# EAGLE schematic MacroPad (EAGLE 9.4.0)
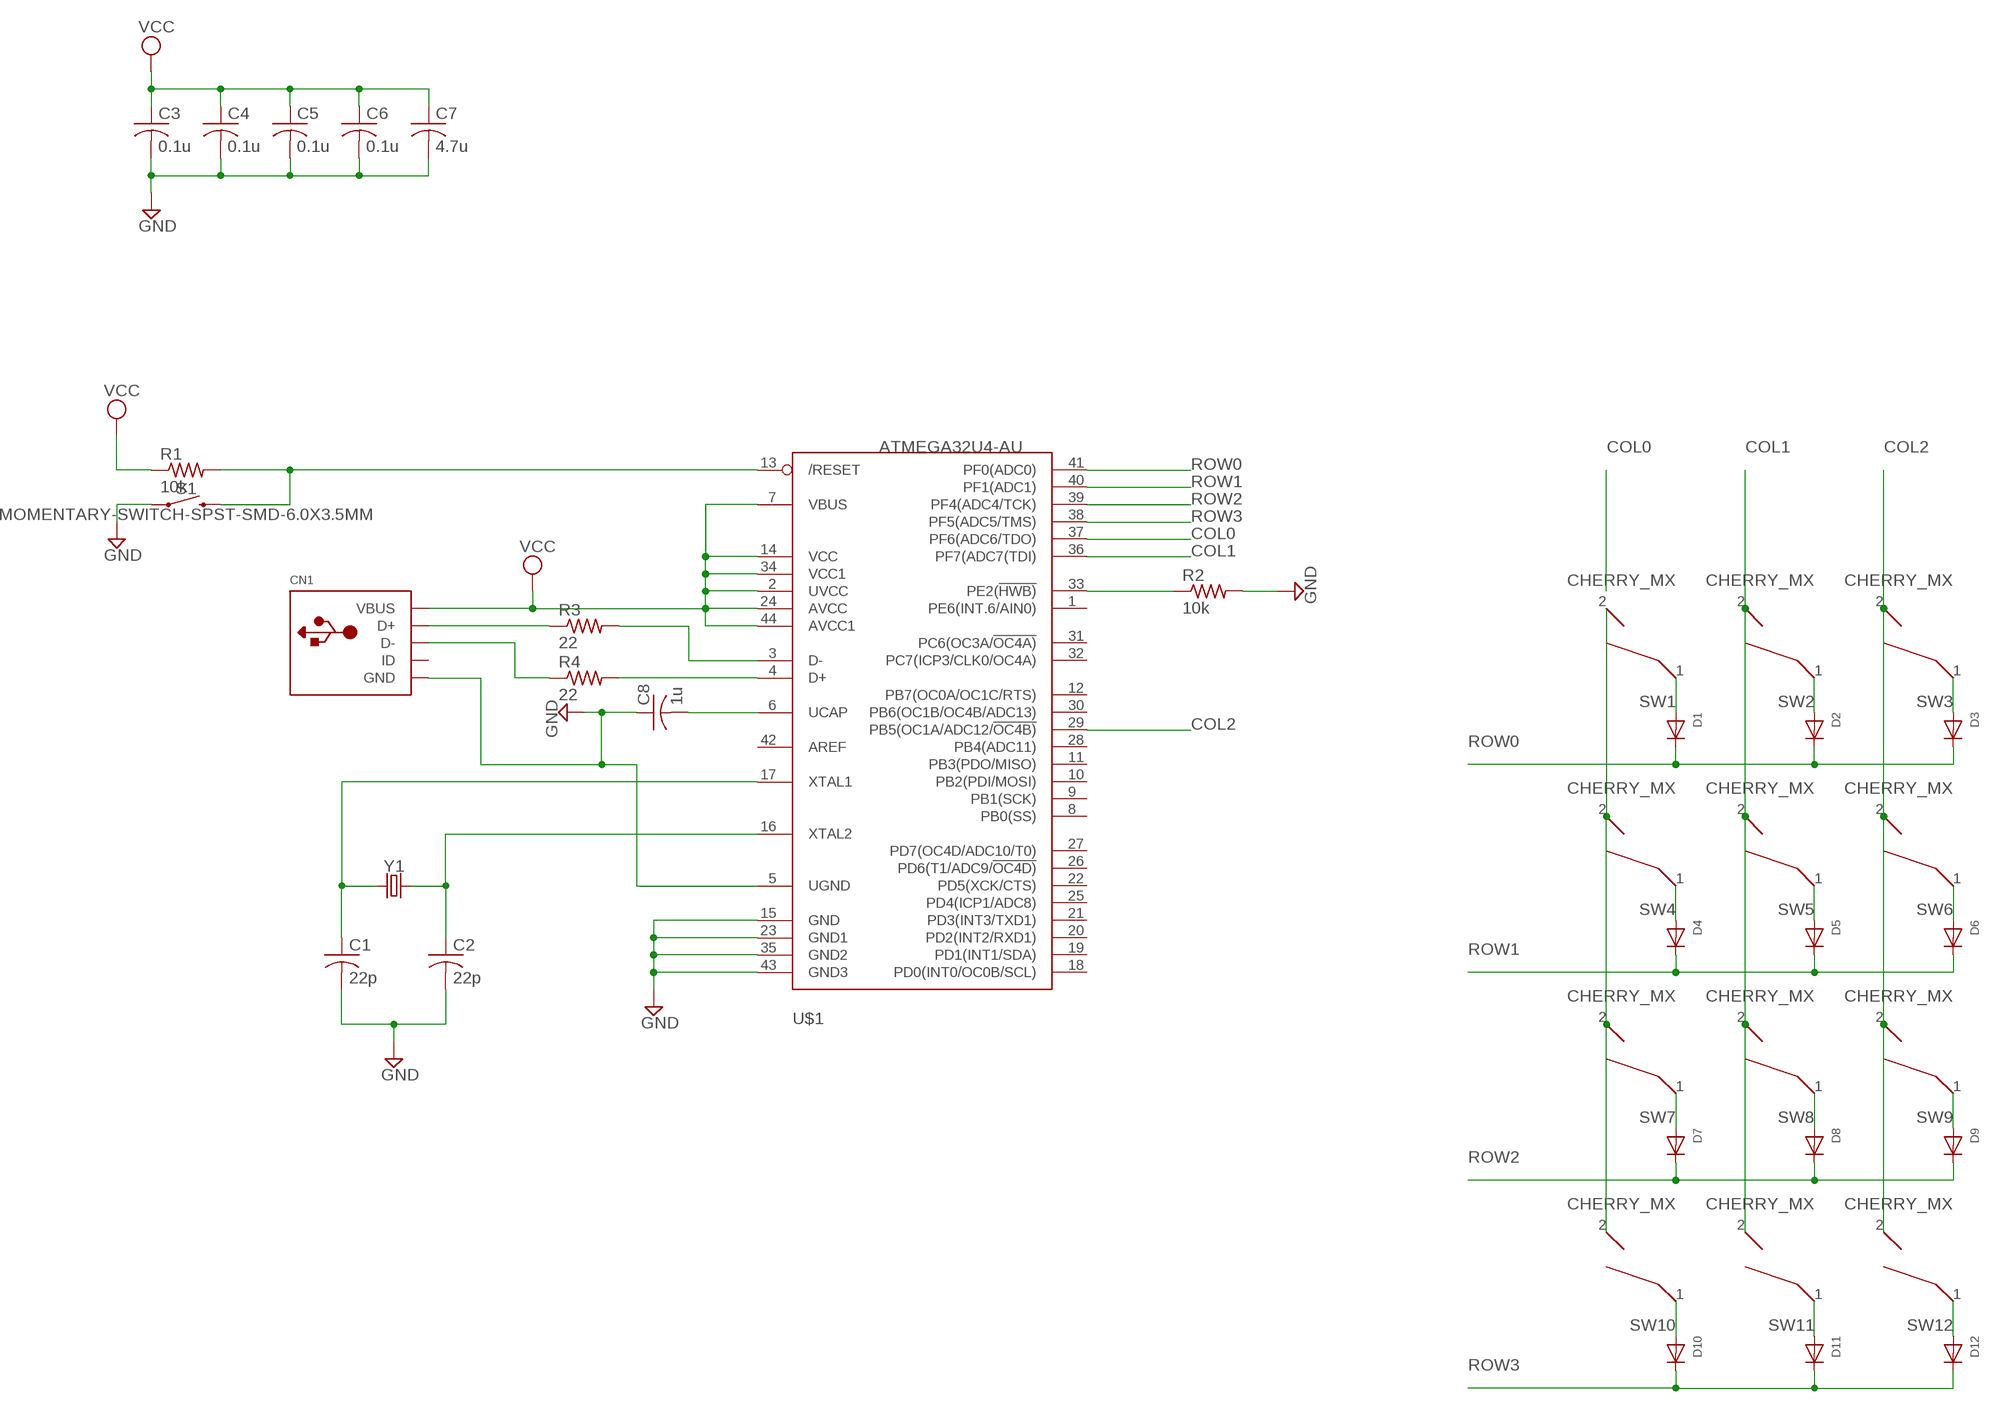
[diagram p0: schematic, sheet 1]

## Parts
C1  22p  C-USC0805  [C0805]
C2  22p  C-USC0805  [C0805]
C3  0.1u  C-USC0805  [C0805]
C4  0.1u  C-USC0805  [C0805]
C5  0.1u  C-USC0805  [C0805]
C6  0.1u  C-USC0805  [C0805]
C7  4.7u  C-USC0805  [C0805]
C8  1u  C-USC0805  [C0805]
CN1  USBMOLEX  [USB-MINIB-THM-MOLEX]
D1  DIODEDO-1N4148  [DO-1N4148]
D2  DIODEDO-1N4148  [DO-1N4148]
D3  DIODEDO-1N4148  [DO-1N4148]
D4  DIODEDO-1N4148  [DO-1N4148]
D5  DIODEDO-1N4148  [DO-1N4148]
D6  DIODEDO-1N4148  [DO-1N4148]
D7  DIODEDO-1N4148  [DO-1N4148]
D8  DIODEDO-1N4148  [DO-1N4148]
D9  DIODEDO-1N4148  [DO-1N4148]
D10  DIODEDO-1N4148  [DO-1N4148]
D11  DIODEDO-1N4148  [DO-1N4148]
D12  DIODEDO-1N4148  [DO-1N4148]
R1  10k  R-US_R0805  [R0805]
R2  10k  R-US_R0805  [R0805]
R3  22  R-US_R0805  [R0805]
R4  22  R-US_R0805  [R0805]
S1  MOMENTARY-SWITCH-SPST-SMD-6.0X3.5MM  [TACTILE_SWITCH_SMD_6.0X3.5MM]
SW1  CHERRY_MX  [MX1A-XXNN]
SW2  CHERRY_MX  [MX1A-XXNN]
SW3  CHERRY_MX  [MX1A-XXNN]
SW4  CHERRY_MX  [MX1A-XXNN]
SW5  CHERRY_MX  [MX1A-XXNN]
SW6  CHERRY_MX  [MX1A-XXNN]
SW7  CHERRY_MX  [MX1A-XXNN]
SW8  CHERRY_MX  [MX1A-XXNN]
SW9  CHERRY_MX  [MX1A-XXNN]
SW10  CHERRY_MX  [MX1A-XXNN]
SW11  CHERRY_MX  [MX1A-XXNN]
SW12  CHERRY_MX  [MX1A-XXNN]
U$1  ATMEGA32U4-AU  [TQFP44]
Y1  CRYSTALSMD-5X3.2-4PAD  [CRYSTAL-SMD-5X3.2-4PAD]

## Nets
COL0: U$1.37(PF6(ADC6/TDO))
COL1: SW2.2 SW5.2 SW8.2 SW11.2 U$1.36(PF7(ADC7(TDI))
COL2: SW3.2 SW6.2 SW9.2 SW12.2 U$1.29(PB5(OC1A/ADC12/!OC4B))
GND: C1.2 C2.2 C3.2 C4.2 C5.2 C6.2 C7.2 C8.1 CN1.GND R2.2 S1.1 U$1.5(UGND) U$1.15(GND) U$1.23(GND1) U$1.35(GND2) U$1.43(GND3)
N$1: C2.1 U$1.16(XTAL2) Y1.3
N$2: R2.1 U$1.33(PE2(!HWB))
N$3: C8.2 U$1.6(UCAP)
N$4: C1.1 U$1.17(XTAL1) Y1.1
N$5: R1.2 S1.2 U$1.13(/RESET)
N$6: CN1.D+ R3.1
N$7: R3.2 U$1.3(D-)
N$8: R4.2 U$1.4(D+)
N$9: CN1.D- R4.1
N$14: D1.A SW1.1
N$15: D2.A SW2.1
N$16: D3.A SW3.1
N$18: SW1.2 SW4.2 SW7.2 SW10.2
N$22: D7.A SW7.1
N$23: D8.A SW8.1
N$24: D9.A SW9.1
N$27: D10.A SW10.1
N$28: D11.A SW11.1
N$29: D12.A SW12.1
N$31: D4.A SW4.1
N$32: D5.A SW5.1
N$33: D6.A SW6.1
ROW0: D1.C D2.C D3.C U$1.41(PF0(ADC0))
ROW1: D4.C D5.C D6.C U$1.40(PF1(ADC1))
ROW2: D7.C D8.C D9.C U$1.39(PF4(ADC4/TCK))
ROW3: D10.C D11.C D12.C U$1.38(PF5(ADC5/TMS))
VCC: C3.1 C4.1 C5.1 C6.1 C7.1 CN1.VBUS R1.1 U$1.2(UVCC) U$1.7(VBUS) U$1.14(VCC) U$1.24(AVCC) U$1.34(VCC1) U$1.44(AVCC1)
Unconnected: CN1.ID U$1.1(PE6(INT.6/AIN0)) U$1.8(PB0(SS)) U$1.9(PB1(SCK)) U$1.10(PB2(PDI/MOSI)) U$1.11(PB3(PDO/MISO)) U$1.12(PB7(OC0A/OC1C/RTS)) U$1.18(PD0(INT0/OC0B/SCL)) U$1.19(PD1(INT1/SDA)) U$1.20(PD2(INT2/RXD1)) U$1.21(PD3(INT3/TXD1)) U$1.22(PD5(XCK/CTS)) U$1.25(PD4(ICP1/ADC8)) U$1.26(PD6(T1/ADC9/!OC4D)) U$1.27(PD7(OC4D/ADC10/T0)) U$1.28(PB4(ADC11)) U$1.30(PB6(OC1B/OC4B/ADC13)) U$1.31(PC6(OC3A/!OC4A)) U$1.32(PC7(ICP3/CLK0/OC4A)) U$1.42(AREF)

## Library data of the parts
C1-C8 = adafruit:C-US: CAPACITOR, American symbol
CN1 = adafruit:USB: USB Connectors USBMINIB - Surface Mount Female Mini-B USB Connector 4UConnector: 06564 By microbuilder.eu Thru-hole RA Female Mini-B USB Connector 4UConnector: 18732 By ladyada.net
D1-D12 = adafruit:DIODE: Diode SMADIODE - SMA Surface Mount Package 20V 1A Schottky Diode Digikey: 641-1014-6-ND DO-1N4148 - Through Hole Small Current Diode SOD-123 20V 1 A (.5mV Vf) Schottky Diode - Digikey: MBRX120TPMSCT-ND SOD-323 10V 570mA (.38mV Vf, 3ns) Schottky Diode - Digikey: ZLLS410CT-ND SOD-523 30V 30mA Schottky Diode (RB751S-40TE61) - Digikey: RB751S-40TE61CT-ND SOT23-R/W - SOT23 Package (R = Solder Paste/Reflow Ovens, W = Hand-Soldering) BAT54Film 40V 300mA - Digikey: 497-7162-1-ND
R1 R3 R4 = adafruit:R-US_: RESISTOR, American symbol; SPICEPREFIX: R
R2 = adafruit:R-US_: RESISTOR, American symbol
S1 = SparkFun-Switches:MOMENTARY-SWITCH-SPST: Momentary Switch (Pushbutton) - SPST Normally-open (NO) SPST momentary switches (buttons, pushbuttons). Variants PTH-12MM - 12mm square, through-hole Momentary Pushbutton Switch - 12mm Square <https://www.sparkfun.com/products/9190> (COM-09190) PTH-6.0MM, PTH-6.0MM-KIT - 6.0mm square, through-hole Mini Pushbutton Switch <https://www.sparkfun.com/products/97> (COM-00097) KIT package intended for soldering kit's - only one side of pads' copper is exposed. PTH-RIGHT-ANGLE-KIT - Right-angle, through-hole Right Angle Tactile Button <https://www.sparkfun.com/products/10791> - Used on SparkFun BigTime Watch Kit <https://www.sparkfun.com/products/11734> SMD-12MM - 12mm square, surface-mount Tactile Button - SMD (12mm) <https://www.sparkfun.com/products/12993> (COM-12993) Used on SparkFun PicoBoard <https://www.sparkfun.com/products/11888> SMD-4.5MM - 4.5mm Square Trackball Switch Used on SparkFun Blackberry Trackballer Breakout <https://www.sparkfun.com/products/13169> SMD-4.6MMX2.8MM - 4.60mm x 2.80mm, surface mount Used on SparkFun SAMD21 Mini Breakout <https://www.sparkfun.com/products/13664> SMD-5.2MM, SMD-5.2-REDUNDANT - 5.2mm square, surface-mount Mini Pushbutton Switch - SMD <https://www.sparkfun.com/products/8720> (COM-08720) Used on Arduino Pro Mini <https://www.sparkfun.com/products/11114> REDUNDANT package connects both switch circuits together SMD-6.0X3.5MM - 6.0 x 3.5mm, surface mount Momentary Reset Switch SMD <https://www.sparkfun.com/products/8229> (COM-08229) SMD-6.2MM-TALL - 6.2mm square, surface mount Tactile Button - SMD (6mm) <https://www.sparkfun.com/products/12992> Used on SparkFun Digital Sandbox <https://www.sparkfun.com/products/12651> SMD-RIGHT-ANGLE - Right-angle, surface mount Used on SparkFun Block for Intel® Edison - Arduino <https://www.sparkfun.com/products/13036>; PROD_ID: SWCH-00815; SF_SKU: COM-08229; SPICEPREFIX: B
SW1-SW12 = Cherry_MX_v7.0:CHERRY_MX
U$1 = adafruit:ATMEGA32U4: http://www.ladyada.net/library/eagle
Y1 = SparkFun-Clocks:CRYSTAL: Crystals (Generic) These are passive quartz crystals, which can be used as a clock source for a microcontroller. Crystal's are two-terminal devices. They require external "load" capacitors to generate an oscillating signal.